# Altium project Salah 4x4.PrjPcb
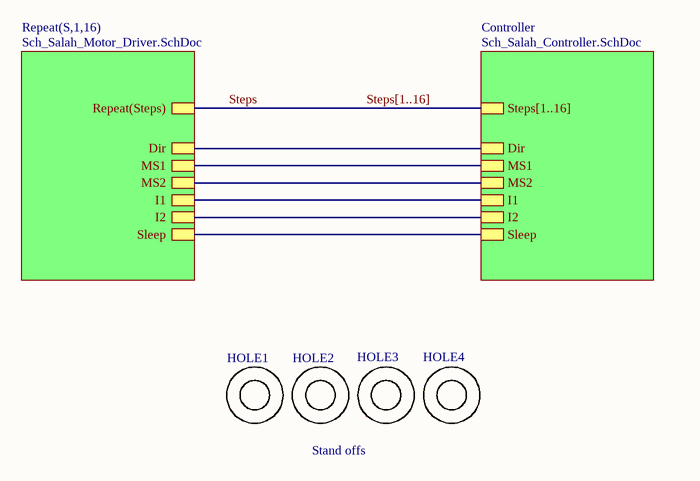
[diagram p0: Sch_Salah_Top.SchDoc]
3 sheets, 61 parts. Net scope: hierarchical (ports join the sheet entries above them; power ports are global).
Board file: PCB_4x4-Salah.PcbDoc
Sheets:
  Sch_Salah_Top.SchDoc
    S1 = Sch_Salah_Motor_Driver.SchDoc
    S2 = Sch_Salah_Motor_Driver.SchDoc
    S3 = Sch_Salah_Motor_Driver.SchDoc
    S4 = Sch_Salah_Motor_Driver.SchDoc
    S5 = Sch_Salah_Motor_Driver.SchDoc
    S6 = Sch_Salah_Motor_Driver.SchDoc
    S7 = Sch_Salah_Motor_Driver.SchDoc
    S8 = Sch_Salah_Motor_Driver.SchDoc
    S9 = Sch_Salah_Motor_Driver.SchDoc
    S10 = Sch_Salah_Motor_Driver.SchDoc
    S11 = Sch_Salah_Motor_Driver.SchDoc
    S12 = Sch_Salah_Motor_Driver.SchDoc
    S13 = Sch_Salah_Motor_Driver.SchDoc
    S14 = Sch_Salah_Motor_Driver.SchDoc
    S15 = Sch_Salah_Motor_Driver.SchDoc
    S16 = Sch_Salah_Motor_Driver.SchDoc
    Controller = Sch_Salah_Controller.SchDoc

## Sheet Sch_Salah_Top.SchDoc
size A2; SheetNumber: 1; SheetTotal: 3

### Parts
HOLE1  M3 Mounting Hole  [M3 STAND OFF - RING]  (value not drawn)
HOLE2  M3 Mounting Hole  [M3 STAND OFF - RING]  (value not drawn)
HOLE3  M3 Mounting Hole  [M3 STAND OFF - RING]  (value not drawn)
HOLE4  M3 Mounting Hole  [M3 STAND OFF - RING]  (value not drawn)

### Sub-sheets
Controller = Sch_Salah_Controller.SchDoc: Steps[1..16], Dir, MS1, MS2, I1, I2, Sleep
Repeat(S,1,16) = Sch_Salah_Motor_Driver.SchDoc: Repeat(Steps), Dir, MS1, MS2, I1, I2, Sleep

### Nets
Dir: sheet Repeat(S,1,16)/Dir, sheet Controller/Dir
I1: sheet Repeat(S,1,16)/I1, sheet Controller/I1
I2: sheet Repeat(S,1,16)/I2, sheet Controller/I2
MS1: sheet Repeat(S,1,16)/MS1, sheet Controller/MS1
MS2: sheet Repeat(S,1,16)/MS2, sheet Controller/MS2
Sleep: sheet Repeat(S,1,16)/Sleep, sheet Controller/Sleep
Steps: sheet Repeat(S,1,16)/Repeat(Steps)

### Buses and harness runs
bus Steps[1..16] = sheet Controller/Steps[1..16]

### Notes on the sheet
- Stand offs

## Sheet Sch_Salah_Motor_Driver.SchDoc
size A2; SheetNumber: 2; SheetTotal: 3
Used 16 times, as channels S1, S2, S3, S4, S5, S6, S7, S8, S9, S10, S11, S12, S13, S14, S15, S16. Parts and nets are listed once, with the designators drawn on the sheet.
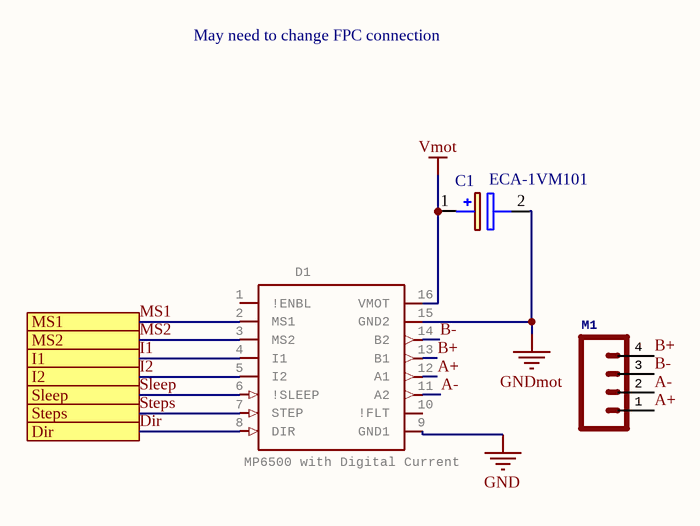
[diagram p1: Sch_Salah_Motor_Driver.SchDoc]

### Parts
C1  ECA-1VM101  [CAPPRD250W55D655H1220]
D1  MP6500 with Digital Current  [MP6500]
M1  (no value)  [JST-4-PTH-VERT]

### Ports
Dir, I1, I2, MS1, MS2, Sleep, Steps

### Nets
GND: D1.9(GND1)
GNDmot: C1.2(-) D1.15(GND2)
Vmot: C1.1(+) D1.16(VMOT)
A+: D1.12(A1) M1.1
A-: D1.11(A2) M1.2
B+: D1.13(B1) M1.4
B-: D1.14(B2) M1.3
Dir: D1.8(DIR) ; port Dir
I1: D1.4(I1) ; port I1
I2: D1.5(I2) ; port I2
MS1: D1.2(MS1) ; port MS1
MS2: D1.3(MS2) ; port MS2
Sleep: D1.6(!SLEEP) ; port Sleep
Steps: D1.7(STEP) ; port Steps

Not connected (* = marked no-connect by the designer): D1 1(!ENBL) 10(!FLT)

### Channels
S1: designators end in A; ports Dir=Dir I1=I1 I2=I2 MS1=MS1 MS2=MS2 Sleep=Sleep Steps=Steps
S2: designators end in B; ports Dir=Dir I1=I1 I2=I2 MS1=MS1 MS2=MS2 Sleep=Sleep Steps=Steps
S3: designators end in C; ports Dir=Dir I1=I1 I2=I2 MS1=MS1 MS2=MS2 Sleep=Sleep Steps=Steps
S4: designators end in D; ports Dir=Dir I1=I1 I2=I2 MS1=MS1 MS2=MS2 Sleep=Sleep Steps=Steps
S5: designators end in E; ports Dir=Dir I1=I1 I2=I2 MS1=MS1 MS2=MS2 Sleep=Sleep Steps=Steps
S6: designators end in F; ports Dir=Dir I1=I1 I2=I2 MS1=MS1 MS2=MS2 Sleep=Sleep Steps=Steps
S7: designators end in G; ports Dir=Dir I1=I1 I2=I2 MS1=MS1 MS2=MS2 Sleep=Sleep Steps=Steps
S8: designators end in H; ports Dir=Dir I1=I1 I2=I2 MS1=MS1 MS2=MS2 Sleep=Sleep Steps=Steps
S9: designators end in I; ports Dir=Dir I1=I1 I2=I2 MS1=MS1 MS2=MS2 Sleep=Sleep Steps=Steps
S10: designators end in J; ports Dir=Dir I1=I1 I2=I2 MS1=MS1 MS2=MS2 Sleep=Sleep Steps=Steps
S11: designators end in K; ports Dir=Dir I1=I1 I2=I2 MS1=MS1 MS2=MS2 Sleep=Sleep Steps=Steps
S12: designators end in L; ports Dir=Dir I1=I1 I2=I2 MS1=MS1 MS2=MS2 Sleep=Sleep Steps=Steps
S13: designators end in M; ports Dir=Dir I1=I1 I2=I2 MS1=MS1 MS2=MS2 Sleep=Sleep Steps=Steps
S14: designators end in N; ports Dir=Dir I1=I1 I2=I2 MS1=MS1 MS2=MS2 Sleep=Sleep Steps=Steps
S15: designators end in O; ports Dir=Dir I1=I1 I2=I2 MS1=MS1 MS2=MS2 Sleep=Sleep Steps=Steps
S16: designators end in P; ports Dir=Dir I1=I1 I2=I2 MS1=MS1 MS2=MS2 Sleep=Sleep Steps=Steps

### Notes on the sheet
- May need to change FPC connection

### Library data of the parts
C1 = ECA-1VM101: Capacitor Polarised; Manufacturer_Name: Panasonic; Datasheet Link: http://uk.rs-online.com/web/p/products/1078023; Height: 12.2mm; Manufacturer_Part_Number: ECA-1VM101; Mouser Part Number: 667-ECA-1VM101; Mouser Price/Stock: https://www.mouser.co.uk/ProductDetail/Panasonic/ECA-1VM101?qs=F80sRR%252BEZdBICPbxyqGQug%3D%3D; Arrow Part Number: ECA-1VM101; Arrow Price/Stock: https://www.arrow.com/en/products/eca-1vm101/panasonic
D1 = 2969-MP6500: GateName_1: G$1; SymbolName_1: MP6500; LibraryName: pololu-stepper-driver; DeviceSetName: 2969-MP6500; Package: MP6500
M1 = CONN_04JST-PTH-VERT: PROD_ID: CONN-13251

## Sheet Sch_Salah_Controller.SchDoc
size A2; SheetNumber: 3; SheetTotal: 3
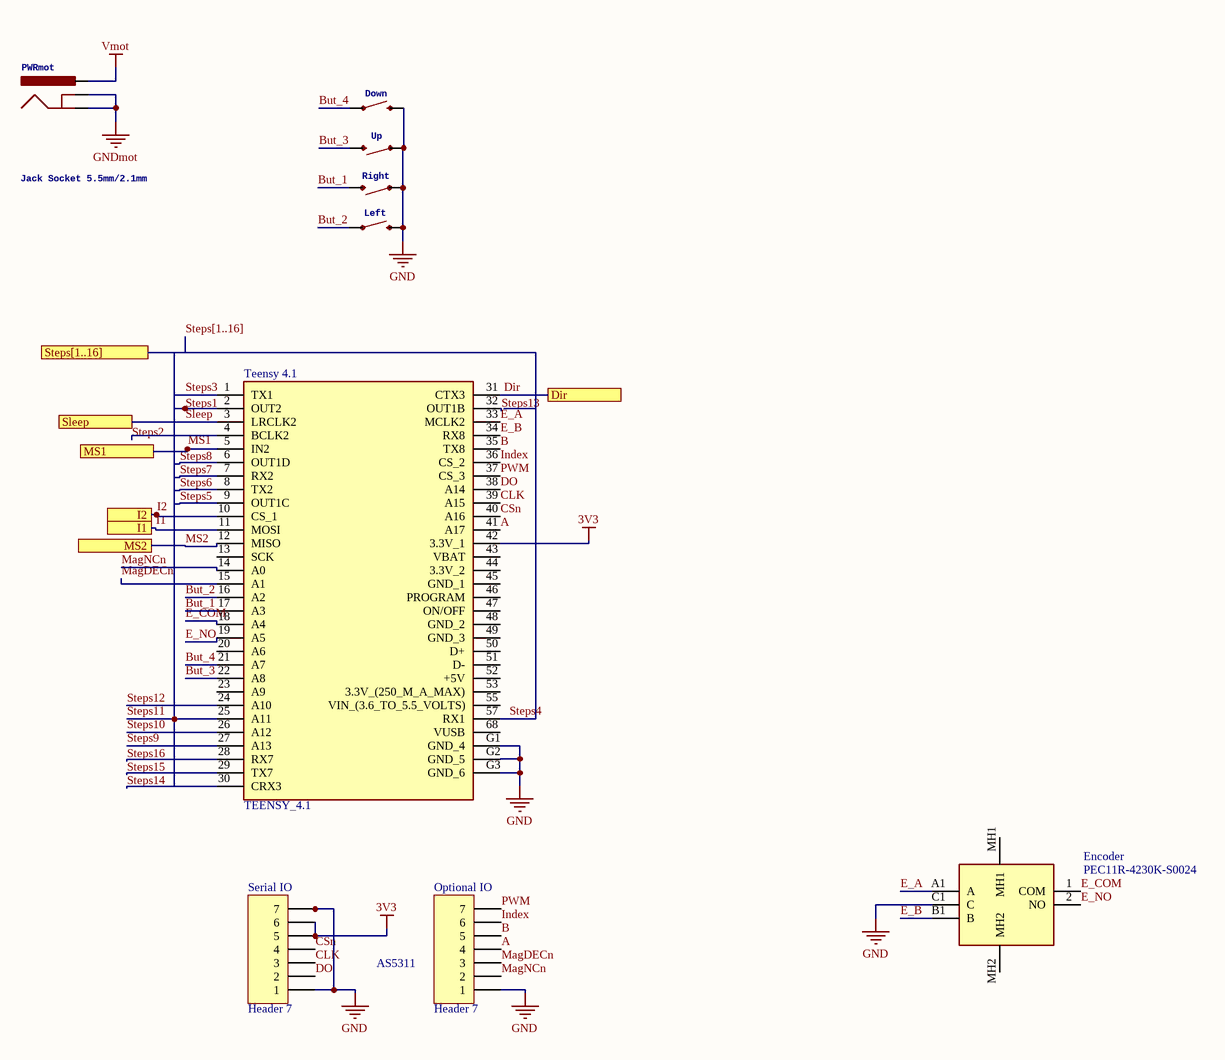
[diagram p2: Sch_Salah_Controller.SchDoc]

### Parts
Down  (no value)  [TACTILE_SWITCH_PTH_6.0MM]
Encoder  PEC11R-4230K-S0024  [PEC11R4230KS0024]
Left  (no value)  [TACTILE_SWITCH_PTH_6.0MM]
Optional_IO  Header 7  [HDR1X7]
PWRmot  Jack Socket 5.5mm/2.1mm  [POWER_JACK_PTH_LOCK]
Right  (no value)  [TACTILE_SWITCH_PTH_6.0MM]
Serial_IO  Header 7  [HDR1X7]
Teensy_4.1  TEENSY_4.1  [TEENSY41]
Up  (no value)  [TACTILE_SWITCH_PTH_6.0MM]

### Ports
Dir, I1, I2, MS1, MS2, Sleep, Steps[1..16]

### Nets
3V3: Serial_IO.5 Serial_IO.6 Teensy_4.1.42(3.3V_1)
GND: Down.3 Encoder.C1(C) Left.3 Optional_IO.1 Right.1 Serial_IO.1 Serial_IO.7 Teensy_4.1.G1(GND_4) Teensy_4.1.G2(GND_5) Teensy_4.1.G3(GND_6) Up.1
GNDmot: PWRmot.GND PWRmot.GNDBREAK
Vmot: PWRmot.PWR
A: Optional_IO.4 Teensy_4.1.41(A17)
B: Optional_IO.5 Teensy_4.1.35(TX8)
But_1: Right.3 Teensy_4.1.17(A3)
But_2: Left.1 Teensy_4.1.16(A2)
But_3: Teensy_4.1.22(A8) Up.3
But_4: Down.1 Teensy_4.1.21(A7)
CLK: Serial_IO.3 Teensy_4.1.39(A15)
CSn: Serial_IO.4 Teensy_4.1.40(A16)
Dir: Teensy_4.1.31(CTX3) ; port Dir
DO: Serial_IO.2 Teensy_4.1.38(A14)
E_A: Encoder.A1(A) Teensy_4.1.33(MCLK2)
E_B: Encoder.B1(B) Teensy_4.1.34(RX8)
E_COM: Encoder.1(COM) Teensy_4.1.18(A4)
E_NO: Encoder.2(NO) Teensy_4.1.19(A5)
I1: Teensy_4.1.11(MOSI) ; port I1
I2: Teensy_4.1.10(CS_1) ; port I2
Index: Optional_IO.6 Teensy_4.1.36(CS_2)
MagDECn: Optional_IO.3 Teensy_4.1.15(A1)
MagNCn: Optional_IO.2 Teensy_4.1.14(A0)
MS1: Teensy_4.1.5(IN2) ; port MS1
MS2: Teensy_4.1.12(MISO) ; port MS2
PWM: Optional_IO.7 Teensy_4.1.37(CS_3)
Sleep: Teensy_4.1.3(LRCLK2) ; port Sleep
Steps1: Teensy_4.1.2(OUT2)  [project net Steps]
Steps2: Teensy_4.1.4(BCLK2)  [project net Steps]
Steps3: Teensy_4.1.1(TX1)  [project net Steps]
Steps4: Teensy_4.1.57(RX1)  [project net Steps]
Steps5: Teensy_4.1.9(OUT1C)  [project net Steps]
Steps6: Teensy_4.1.8(TX2)  [project net Steps]
Steps7: Teensy_4.1.7(RX2)  [project net Steps]
Steps8: Teensy_4.1.6(OUT1D)  [project net Steps]
Steps9: Teensy_4.1.27(A13)  [project net Steps]
Steps10: Teensy_4.1.26(A12)  [project net Steps]
Steps11: Teensy_4.1.25(A11)  [project net Steps]
Steps12: Teensy_4.1.24(A10)  [project net Steps]
Steps13: Teensy_4.1.32(OUT1B)  [project net Steps]
Steps14: Teensy_4.1.30(CRX3)  [project net Steps]
Steps15: Teensy_4.1.29(TX7)  [project net Steps]
Steps16: Teensy_4.1.28(RX7)  [project net Steps]

Not connected (* = marked no-connect by the designer): Encoder MH1 MH2; Teensy_4.1 13(SCK) 20(A6) 23(A9) 43(VBAT) 44(3.3V_2) 45(GND_1) 46(PROGRAM) 47(ON/OFF) 48(GND_2) 49(GND_3) 50(D+) 51(D-) 52(+5V) 53(3.3V_(250_M_A_MAX)) 55(VIN_(3.6_TO_5.5_VOLTS)) 68(VUSB)

### Buses and harness runs
bus Steps[1..16] = port Steps[1..16]

### Notes on the sheet
- AS5311

### Library data of the parts
Down Left Right Up = MOMENTARY-SWITCH-SPST-PTH-6.0MM: PROD_ID: SWCH-08441; SF_SKU: COM-00097
Encoder = PEC11R-4230K-S0024: Integrated Circuit; Manufacturer_Name: Bourns; Datasheet Link: https://www.mouser.co.uk/datasheet/2/54/PEC11R-777457.pdf; Height: 36.5mm; Manufacturer_Part_Number: PEC11R-4230K-S0024; Mouser Part Number: 652-PEC11R4230KS0024; Mouser Price/Stock: https://www.mouser.co.uk/ProductDetail/Bourns/PEC11R-4230K-S0024?qs=5aG0NVq1C4wTaYIm44OGuA%3D%3D
Optional_IO Serial_IO = Header 7: Header, 7-Pin; LatestRevisionDate: 17-Jul-2002; LatestRevisionNote: Re-released for DXP Platform.; Publisher: Altium Limited
PWRmot = POWER_JACKPTH_LOCK: PROD_ID: CONN-08197; SF_ID: PRT-00119
Teensy_4.1 = TEENSY_4.1: Integrated Circuit; Manufacturer_Name: PJRC; Manufacturer_Part_Number: TEENSY 4.1; Datasheet Link: https://www.pjrc.com/store/teensy41.html; Height: 4.07mm

## Nets that join several sheets
GND: S1 (D1A.9), S2 (D1B.9), S3 (D1C.9), S4 (D1D.9), S5 (D1E.9), S6 (D1F.9), S7 (D1G.9), S8 (D1H.9), S9 (D1I.9), S10 (D1J.9), S11 (D1K.9), S12 (D1L.9), S13 (D1M.9), S14 (D1N.9), S15 (D1O.9), S16 (D1P.9), Sch_Salah_Controller (11 pins)
GNDmot: S1 (C1A.2 D1A.15), S2 (C1B.2 D1B.15), S3 (C1C.2 D1C.15), S4 (C1D.2 D1D.15), S5 (C1E.2 D1E.15), S6 (C1F.2 D1F.15), S7 (C1G.2 D1G.15), S8 (C1H.2 D1H.15), S9 (C1I.2 D1I.15), S10 (C1J.2 D1J.15), S11 (C1K.2 D1K.15), S12 (C1L.2 D1L.15), S13 (C1M.2 D1M.15), S14 (C1N.2 D1N.15), S15 (C1O.2 D1O.15), S16 (C1P.2 D1P.15), Sch_Salah_Controller (PWRmot.GND PWRmot.GNDBREAK)
Vmot: S1 (C1A.1 D1A.16), S2 (C1B.1 D1B.16), S3 (C1C.1 D1C.16), S4 (C1D.1 D1D.16), S5 (C1E.1 D1E.16), S6 (C1F.1 D1F.16), S7 (C1G.1 D1G.16), S8 (C1H.1 D1H.16), S9 (C1I.1 D1I.16), S10 (C1J.1 D1J.16), S11 (C1K.1 D1K.16), S12 (C1L.1 D1L.16), S13 (C1M.1 D1M.16), S14 (C1N.1 D1N.16), S15 (C1O.1 D1O.16), S16 (C1P.1 D1P.16), Sch_Salah_Controller (PWRmot.PWR)
Dir: S1 (D1A.8), S2 (D1B.8), S3 (D1C.8), S4 (D1D.8), S5 (D1E.8), S6 (D1F.8), S7 (D1G.8), S8 (D1H.8), S9 (D1I.8), S10 (D1J.8), S11 (D1K.8), S12 (D1L.8), S13 (D1M.8), S14 (D1N.8), S15 (D1O.8), S16 (D1P.8), Sch_Salah_Controller (Teensy_4.1.31)
I1: S1 (D1A.4), S2 (D1B.4), S3 (D1C.4), S4 (D1D.4), S5 (D1E.4), S6 (D1F.4), S7 (D1G.4), S8 (D1H.4), S9 (D1I.4), S10 (D1J.4), S11 (D1K.4), S12 (D1L.4), S13 (D1M.4), S14 (D1N.4), S15 (D1O.4), S16 (D1P.4), Sch_Salah_Controller (Teensy_4.1.11)
I2: S1 (D1A.5), S2 (D1B.5), S3 (D1C.5), S4 (D1D.5), S5 (D1E.5), S6 (D1F.5), S7 (D1G.5), S8 (D1H.5), S9 (D1I.5), S10 (D1J.5), S11 (D1K.5), S12 (D1L.5), S13 (D1M.5), S14 (D1N.5), S15 (D1O.5), S16 (D1P.5), Sch_Salah_Controller (Teensy_4.1.10)
MS1: S1 (D1A.2), S2 (D1B.2), S3 (D1C.2), S4 (D1D.2), S5 (D1E.2), S6 (D1F.2), S7 (D1G.2), S8 (D1H.2), S9 (D1I.2), S10 (D1J.2), S11 (D1K.2), S12 (D1L.2), S13 (D1M.2), S14 (D1N.2), S15 (D1O.2), S16 (D1P.2), Sch_Salah_Controller (Teensy_4.1.5)
MS2: S1 (D1A.3), S2 (D1B.3), S3 (D1C.3), S4 (D1D.3), S5 (D1E.3), S6 (D1F.3), S7 (D1G.3), S8 (D1H.3), S9 (D1I.3), S10 (D1J.3), S11 (D1K.3), S12 (D1L.3), S13 (D1M.3), S14 (D1N.3), S15 (D1O.3), S16 (D1P.3), Sch_Salah_Controller (Teensy_4.1.12)
Sleep: S1 (D1A.6), S2 (D1B.6), S3 (D1C.6), S4 (D1D.6), S5 (D1E.6), S6 (D1F.6), S7 (D1G.6), S8 (D1H.6), S9 (D1I.6), S10 (D1J.6), S11 (D1K.6), S12 (D1L.6), S13 (D1M.6), S14 (D1N.6), S15 (D1O.6), S16 (D1P.6), Sch_Salah_Controller (Teensy_4.1.3)
Steps: S1 (D1A.7), Sch_Salah_Controller (Teensy_4.1.2)
Steps: S2 (D1B.7), Sch_Salah_Controller (Teensy_4.1.4)
Steps: S3 (D1C.7), Sch_Salah_Controller (Teensy_4.1.1)
Steps: S4 (D1D.7), Sch_Salah_Controller (Teensy_4.1.57)
Steps: S5 (D1E.7), Sch_Salah_Controller (Teensy_4.1.9)
Steps: S6 (D1F.7), Sch_Salah_Controller (Teensy_4.1.8)
Steps: S7 (D1G.7), Sch_Salah_Controller (Teensy_4.1.7)
Steps: S8 (D1H.7), Sch_Salah_Controller (Teensy_4.1.6)
Steps: S9 (D1I.7), Sch_Salah_Controller (Teensy_4.1.27)
Steps: S10 (D1J.7), Sch_Salah_Controller (Teensy_4.1.26)
Steps: S11 (D1K.7), Sch_Salah_Controller (Teensy_4.1.25)
Steps: S12 (D1L.7), Sch_Salah_Controller (Teensy_4.1.24)
Steps: S13 (D1M.7), Sch_Salah_Controller (Teensy_4.1.32)
Steps: S14 (D1N.7), Sch_Salah_Controller (Teensy_4.1.30)
Steps: S15 (D1O.7), Sch_Salah_Controller (Teensy_4.1.29)
Steps: S16 (D1P.7), Sch_Salah_Controller (Teensy_4.1.28)